# Altium schematic sheet Pulse_to_DTMF_Converter.schdoc
size 297 x 161 mm
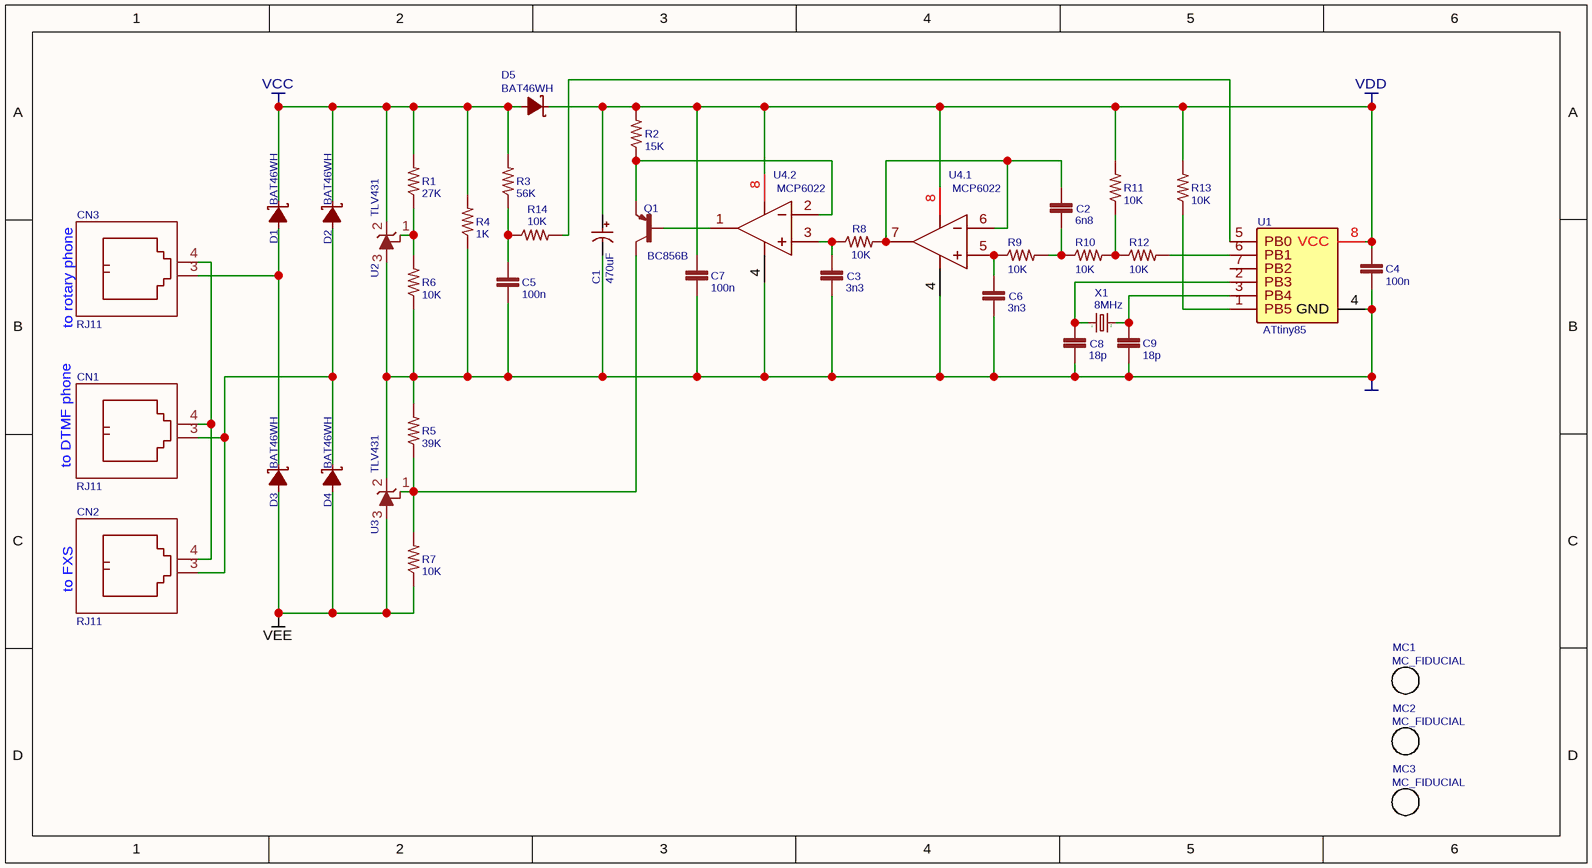
[diagram p0: Pulse_to_DTMF_Converter.schdoc]

## Parts
C1  470uF  [CAP-D8.0XF3.5]
C2  6n8  [CA_1206]
C3  3n3  [CA_1206]
C4  100n  [CA_1206]
C5  100n  [CA_1206]
C6  3n3  [CA_1206]
C7  100n  [CA_1206]
C8  18p  [CA_1206]
C9  18p  [CA_1206]
CN1  RJ11  [6P6C]
CN2  RJ11  [6P6C]
CN3  RJ11  [6P6C]
D1  BAT46WH  [DI_SOD123W]
D2  BAT46WH  [DI_SOD123W]
D3  BAT46WH  [DI_SOD123W]
D4  BAT46WH  [DI_SOD123W]
D5  BAT46WH  [DI_SOD123W]
MC1  MC_FIDUCIAL  [MC_FIDUCIAL]
MC2  MC_FIDUCIAL  [MC_FIDUCIAL]
MC3  MC_FIDUCIAL  [MC_FIDUCIAL]
Q1  BC856B  [SC_SOT23-3]
R1  27K  [RE_1206]
R2  15K  [RE_1206]
R3  56K  [RE_1206]
R4  1K  [RE_1206]
R5  39K  [RE_1206]
R6  10K  [RE_1206]
R7  10K  [RE_1206]
R8  10K  [RE_1206]
R9  10K  [RE_1206]
R10  10K  [RE_1206]
R11  10K  [RE_1206]
R12  10K  [RE_1206]
R13  10K  [RE_1206]
R14  10K  [RE_1206]
U1  ATtiny85  [SC_SO08_208MIL_BODY]
U2  TLV431  [SC_SOT23-3]
U3  TLV431  [SC_SOT23-3]
U4.1  MCP6022  [SC_SO08_150MIL_BODY]
U4.2  MCP6022  [SC_SO08_150MIL_BODY]
X1  8MHz  [XT_HC49/US]

## Nets
GND: C1.2 C3.2 C4.2 C5.2 C6.2 C7.2 C8.2 C9.2 R4.1 R5.2 R6.1 U1.4(GND) U2.3(A) U3.2(C) U4.1.4(VSS) U4.2.4(VSS)
VCC: D1.C(K) D2.C(K) D5.A R1.2 R3.2 R4.2 U2.2(C)
VDD: C1.1 C4.1 C7.1 D5.C(K) R2.2 R11.2 R13.2 U1.8(VCC) U4.1.8(VDD) U4.2.8(VDD)
VEE: D3.A D4.A R7.1 U3.3(A)
NetC2_1: C2.1 R8.2 U4.1.6(VINB-) U4.1.7(VOUTB)
NetC2_2: C2.2 R9.2 R10.1
NetC3_1: C3.1 R8.1 U4.2.3(VINA+)
NetC5_1: C5.1 R3.1 R14.1
NetC6_1: C6.1 R9.1 U4.1.5(VINB+)
NetC8_1: C8.1 U1.2(PB3) X1.1
NetC9_1: C9.1 U1.3(PB4) X1.2
NetCN1_3: CN1.3 CN2.3 D2.A D4.C(K)
NetCN1_4: CN1.4 CN2.4 CN3.4
NetCN3_3: CN3.3 D1.A D3.C(K)
NetQ1_1: Q1.1(B) U4.2.1(VOUTA)
NetQ1_2: Q1.2(E) R2.1 U4.2.2(VINA-)
NetQ1_3: Q1.3(C) R5.1 R7.2 U3.1(R)
NetR1_1: R1.1 R6.2 U2.1(R)
NetR10_2: R10.2 R11.1 R12.1
NetR12_2: R12.2 U1.6(PB1)
NetR13_1: R13.1 U1.1(PB5)
NetR14_2: R14.2 U1.5(PB0)

Not connected (* = marked no-connect by the designer): U1 7(PB2)

## Notes on the sheet
- to rotary phone
- to DTMF phone
- to FXS

## Library data of the parts
C2 = (no symbol name): catid: 20; description: 6n8 1206 50V; BOM_Supplier: LCSC; BOM_Digi-Key: 1276-1775-1-ND; BOM_LCSC: C1879; BOM_Manufacturer Part: ?; spicePre: C
C3 C6 = (no symbol name): catid: 20; description: 3n3 1206 50V; BOM_Supplier: LCSC; BOM_Digi-Key: 1276-2772-1-ND; BOM_LCSC: C1863; BOM_Manufacturer Part: ?; spicePre: C
C4 C5 C7 = (no symbol name): catid: 20; description: 100n 1206 50V; BOM_Supplier: LCSC; BOM_Digi-Key: 1276-1017-1-ND; BOM_LCSC: C1945; BOM_Manufacturer Part: ?; spicePre: C
C8 C9 = (no symbol name): catid: 20; description: 18p 1206 50V; BOM_Supplier: LCSC; BOM_Digi-Key: 1276-1844-1-ND; BOM_LCSC: C1889; BOM_Manufacturer Part: ?; spicePre: C
MC1-MC3 = (no symbol name): Contributor: LieBtrau; BOM_Mounted: No; BOM_Manufacturer Part: MC_FIDUCIAL; spicePre: M
Q1 R4 U1 = (no symbol name): catid: 20; BOM_Supplier: LCSC; BOM_Manufacturer Part: ?
  Q1: BOM_Digi-Key: BC856BLT1GOSCT-ND; BOM_LCSC: C181144; spicePre: Q
  R4: BOM_Digi-Key: 311-1.00KFRCT-ND; BOM_LCSC: C104594; spicePre: R
  U1: BOM_Digi-Key: ATTINY85V-10SU-ND; BOM_LCSC: C152192; spicePre: U
R1-R3 R5-R14 = (no symbol name): catid: 20; description: Yageo RC1206; BOM_Supplier: LCSC; BOM_Manufacturer Part: ?; spicePre: R
  R1: BOM_Digi-Key: 311-27.0KFRCT-ND; BOM_LCSC: C104726
  R2: BOM_Digi-Key: 311-15.0KFRCT-ND; BOM_LCSC: C104639
  R3: BOM_Digi-Key: 311-56.0KFRCT-ND; BOM_LCSC: C102223
  R5: BOM_Digi-Key: 311-39.0KFRCT-ND; BOM_LCSC: C104791
  R6-R14: BOM_Digi-Key: 311-10.0KFRCT-ND; BOM_LCSC: C104595
U2 U3 = (no symbol name): catid: 20; description: null; BOM_Supplier: LCSC; BOM_Digi-Key: TLV431ASN1T1GOSCT-ND; BOM_LCSC: C56765; BOM_Manufacturer Part: ?; spicePre: U
X1 = (no symbol name): catid: 20; description: 8MHz, 18pF; BOM_Supplier: LCSC; BOM_Digi-Key: GC0800002CT-ND; BOM_LCSC: C108703; BOM_Manufacturer Part: ?; spicePre: X
C1 CN1-CN3 D1-D5 U4.1 U4.2 = (no symbol name): BOM_Manufacturer Part: ?
  C1: BOM_Supplier: Digi-Key; BOM_LCSC: C43324; BOM_Digi-Key: 732-9077-1-ND; spicePre: C
  CN1-CN3: BOM_Supplier: LCSC; BOM_Digi-Key: 0520186246-ND; BOM_LCSC: C77857; spicePre: C
  D1-D5: BOM_Supplier: LCSC; BOM_LCSC: C127989; BOM_Digi-Key: 1727-7326-1-ND; spicePre: D
  U4.1: BOM_Supplier: LCSC; BOM_LCSC: C57639; BOM_Digi-Key: MCP6022T-I/SNCT-ND; spicePre: U
  U4.2: BOM_Supplier: Digi-Key; BOM_LCSC: C57639; BOM_Digi-Key: MCP6022T-I/SNCT-ND; spicePre: U